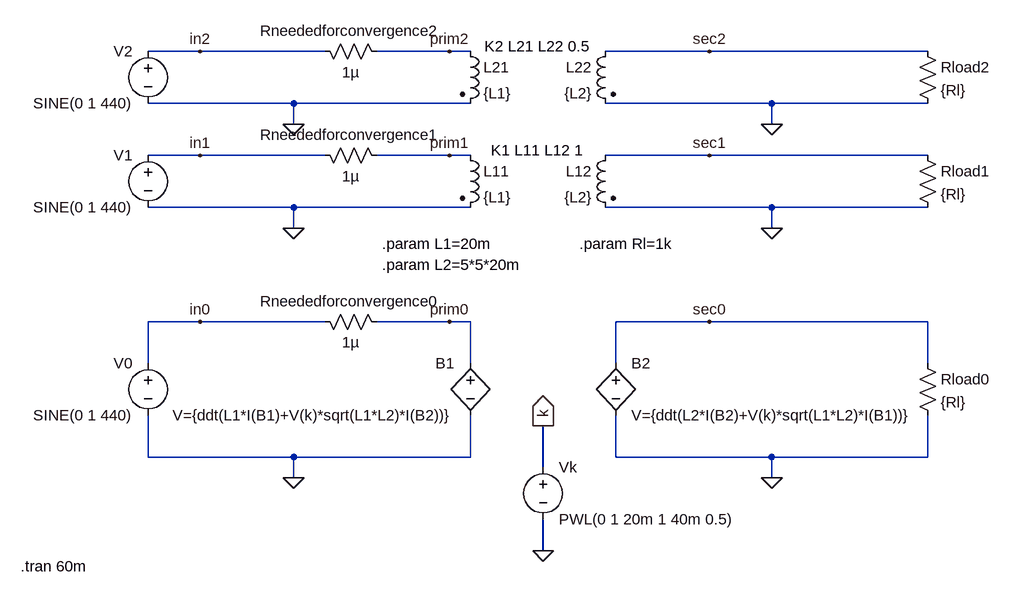
[diagram p0: schematic TimeVariableCoupling.asc]
TimeVariableCoupling.asc, the LTspice schematic file:
Version 4
SHEET 1 972 680
WIRE -256 -368 -336 -368
WIRE -64 -368 -256 -368
WIRE 128 -368 16 -368
WIRE 160 -368 128 -368
WIRE 528 -368 368 -368
WIRE 864 -368 528 -368
WIRE -112 -288 -336 -288
WIRE 160 -288 -112 -288
WIRE 624 -288 368 -288
WIRE 864 -288 624 -288
WIRE -112 -256 -112 -288
WIRE 624 -256 624 -288
WIRE -256 -208 -336 -208
WIRE -64 -208 -256 -208
WIRE 128 -208 16 -208
WIRE 160 -208 128 -208
WIRE 528 -208 368 -208
WIRE 864 -208 528 -208
WIRE -112 -128 -336 -128
WIRE 160 -128 -112 -128
WIRE 624 -128 368 -128
WIRE 864 -128 624 -128
WIRE -112 -96 -112 -128
WIRE 624 -96 624 -128
WIRE -256 48 -336 48
WIRE -64 48 -256 48
WIRE 128 48 16 48
WIRE 160 48 128 48
WIRE 528 48 384 48
WIRE 864 48 528 48
WIRE -336 112 -336 48
WIRE 160 112 160 48
WIRE 384 112 384 48
WIRE 864 112 864 48
WIRE -336 256 -336 192
WIRE -112 256 -336 256
WIRE 160 256 160 192
WIRE 160 256 -112 256
WIRE 384 256 384 192
WIRE 624 256 384 256
WIRE 864 256 864 192
WIRE 864 256 624 256
WIRE 272 272 272 208
WIRE -112 288 -112 256
WIRE 624 288 624 256
WIRE 272 400 272 352
FLAG 272 400 0
FLAG -112 288 0
FLAG 624 288 0
FLAG 272 208 k
IOPIN 272 208 Out
FLAG -112 -96 0
FLAG -112 -256 0
FLAG 624 -96 0
FLAG 624 -256 0
FLAG -256 48 in0
FLAG -256 -208 in1
FLAG -256 -368 in2
FLAG 128 48 prim0
FLAG 128 -208 prim1
FLAG 128 -368 prim2
FLAG 528 48 sec0
FLAG 528 -208 sec1
FLAG 528 -368 sec2
SYMBOL bv 160 96 M0
SYMATTR InstName B1
SYMATTR Value V={ddt(L1*I(B1)+V(k)*sqrt(L1*L2)*I(B2))}
SYMBOL bv 384 96 R0
SYMATTR InstName B2
SYMATTR Value V={ddt(L2*I(B2)+V(k)*sqrt(L1*L2)*I(B1))}
SYMBOL voltage -336 96 M0
WINDOW 123 0 0 Left 0
WINDOW 39 0 0 Left 0
SYMATTR InstName V0
SYMATTR Value SINE(0 1 440)
SYMBOL voltage 272 256 R0
WINDOW 123 0 0 Left 0
WINDOW 39 0 0 Left 0
SYMATTR InstName Vk
SYMATTR Value PWL(0 1 20m 1 40m 0.5)
SYMBOL res 848 96 R0
SYMATTR InstName Rload0
SYMATTR Value {Rl}
SYMBOL ind2 144 -224 R0
SYMATTR InstName L11
SYMATTR Value {L1}
SYMATTR Type ind
SYMBOL ind2 384 -224 M0
SYMATTR InstName L12
SYMATTR Value {L2}
SYMATTR Type ind
SYMBOL ind2 144 -384 R0
SYMATTR InstName L21
SYMATTR Value {L1}
SYMATTR Type ind
SYMBOL ind2 384 -384 M0
SYMATTR InstName L22
SYMATTR Value {L2}
SYMATTR Type ind
SYMBOL res 848 -224 R0
SYMATTR InstName Rload1
SYMATTR Value {Rl}
SYMBOL res 848 -384 R0
SYMATTR InstName Rload2
SYMATTR Value {Rl}
SYMBOL voltage -336 -384 M0
WINDOW 123 0 0 Left 0
WINDOW 39 0 0 Left 0
SYMATTR InstName V2
SYMATTR Value SINE(0 1 440)
SYMBOL voltage -336 -224 M0
WINDOW 123 0 0 Left 0
WINDOW 39 0 0 Left 0
SYMATTR InstName V1
SYMATTR Value SINE(0 1 440)
SYMBOL res -80 32 M90
WINDOW 0 0 56 VBottom 0
WINDOW 3 32 56 VTop 0
SYMATTR InstName Rneededforconvergence0
SYMATTR Value 1µ
SYMBOL res -80 -224 M90
WINDOW 0 0 56 VBottom 0
WINDOW 3 32 56 VTop 0
SYMATTR InstName Rneededforconvergence1
SYMATTR Value 1µ
SYMBOL res -80 -384 M90
WINDOW 0 0 56 VBottom 0
WINDOW 3 32 56 VTop 0
SYMATTR InstName Rneededforconvergence2
SYMATTR Value 1µ
TEXT 264 -216 Center 0 !K1 L11 L12 1
TEXT 264 -376 Center 0 !K2 L21 L22 0.5
TEXT 24 -72 Left 0 !.param L1=20m
TEXT 24 -40 Left 0 !.param L2=5*5*20m
TEXT 328 -72 Left 0 !.param Rl=1k
TEXT -532 424 Left 0 !.tran 60m

The netlist it stands for:
* TimeVariableCoupling.asc
B1 prim0 0 V={ddt(L1*I(B1)+V(k)*sqrt(L1*L2)*I(B2))}
B2 sec0 0 V={ddt(L2*I(B2)+V(k)*sqrt(L1*L2)*I(B1))}
V0 in0 0 SINE(0 1 440)
Vk k 0 PWL(0 1 20m 1 40m 0.5)
Rload0 sec0 0 {Rl}
L11 prim1 0 {L1}
L12 sec1 0 {L2}
L21 prim2 0 {L1}
L22 sec2 0 {L2}
Rload1 sec1 0 {Rl}
Rload2 sec2 0 {Rl}
V2 in2 0 SINE(0 1 440)
V1 in1 0 SINE(0 1 440)
Rneededforconvergence0 in0 prim0 1µ
Rneededforconvergence1 in1 prim1 1µ
Rneededforconvergence2 in2 prim2 1µ
K1 L11 L12 1
K2 L21 L22 0.5
.param L1=20m
.param L2=5*5*20m
.param Rl=1k
.tran 60m
.backanno
.end